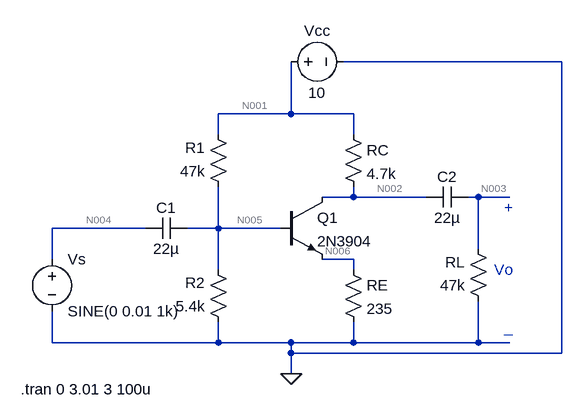
[diagram p0: schematic Lab8Pre2.asc]
Lab8Pre2.asc, the LTspice schematic file:
Version 4
SHEET 1 880 680
WIRE 832 -80 496 -80
WIRE 416 0 416 -80
WIRE 416 0 304 0
WIRE 512 0 416 0
WIRE 304 32 304 0
WIRE 512 32 512 0
WIRE 512 128 512 112
WIRE 512 128 464 128
WIRE 624 128 512 128
WIRE 704 128 688 128
WIRE 752 128 704 128
WIRE 192 176 48 176
WIRE 304 176 304 112
WIRE 304 176 256 176
WIRE 400 176 304 176
WIRE 704 208 704 128
WIRE 48 224 48 176
WIRE 512 224 464 224
WIRE 304 240 304 176
WIRE 512 240 512 224
WIRE 48 352 48 304
WIRE 304 352 304 320
WIRE 304 352 48 352
WIRE 416 352 304 352
WIRE 512 352 512 320
WIRE 512 352 416 352
WIRE 704 352 704 288
WIRE 704 352 512 352
WIRE 752 352 704 352
WIRE 416 368 416 352
WIRE 832 368 832 -80
WIRE 832 368 416 368
WIRE 416 400 416 368
FLAG 416 400 0
SYMBOL cap 256 160 R90
WINDOW 0 0 32 VBottom 2
WINDOW 3 32 32 VTop 2
SYMATTR InstName C1
SYMATTR Value 22µ
SYMBOL cap 624 144 R270
WINDOW 0 32 32 VTop 2
WINDOW 3 0 32 VBottom 2
SYMATTR InstName C2
SYMATTR Value 22µ
SYMBOL res 320 128 R180
WINDOW 0 36 76 Left 2
WINDOW 3 36 40 Left 2
SYMATTR InstName R1
SYMATTR Value 47k
SYMBOL res 320 336 R180
WINDOW 0 36 76 Left 2
WINDOW 3 36 40 Left 2
SYMATTR InstName R2
SYMATTR Value 5.4k
SYMBOL res 496 224 R0
SYMATTR InstName RE
SYMATTR Value 235
SYMBOL res 496 16 R0
SYMATTR InstName RC
SYMATTR Value 4.7k
SYMBOL npn 400 128 R0
SYMATTR InstName Q1
SYMATTR Value 2N3904
SYMBOL voltage 400 -80 R270
WINDOW 0 32 56 VTop 2
WINDOW 3 -32 56 VBottom 2
SYMATTR InstName Vcc
SYMATTR Value 10
SYMBOL voltage 48 208 R0
WINDOW 123 0 0 Left 2
WINDOW 39 0 0 Left 2
SYMATTR InstName Vs
SYMATTR Value SINE(0 0.01 1k)
SYMBOL res 720 304 R180
WINDOW 0 36 76 Left 2
WINDOW 3 36 40 Left 2
SYMATTR InstName RL
SYMATTR Value 47k
TEXT 728 240 Left 2 ;Vo
TEXT 744 144 Left 2 ;+
TEXT 744 328 Left 2 ;_
TEXT 0 424 Left 2 !.tran 0 3.01 3 100u

The netlist it stands for:
* Lab8Pre2.asc
C1 N005 N004 22µ
C2 N002 N003 22µ
R1 N005 N001 47k
R2 0 N005 5.4k
RE N006 0 235
RC N001 N002 4.7k
Q1 N002 N005 N006 0 2N3904
Vcc N001 0 10
Vs N004 0 SINE(0 0.01 1k)
RL 0 N003 47k
.model NPN NPN
.model PNP PNP
.lib standard.bjt
* Vo
* +
* _
.tran 0 3.01 3 100u
.backanno
.end

* Results of the author's LTspice run, read from the files saved beside the schematic
* Operating Point, zero values left out:
*   V(n005) = 1.007 V
*   V(n002) = 3.165 V
*   V(n001) = 10 V
*   V(n006) = 342.9 mV
*   Ic(Q1) = 1.454 mA
*   Ib(Q1) = 4.762 µA
*   Ie(Q1) = -1.459 mA
*   I(Rc) = 1.454 mA
*   I(Re) = 1.459 mA
*   I(R2) = -186.6 µA
*   I(R1) = -191.3 µA
*   I(Vcc) = -1.646 mA
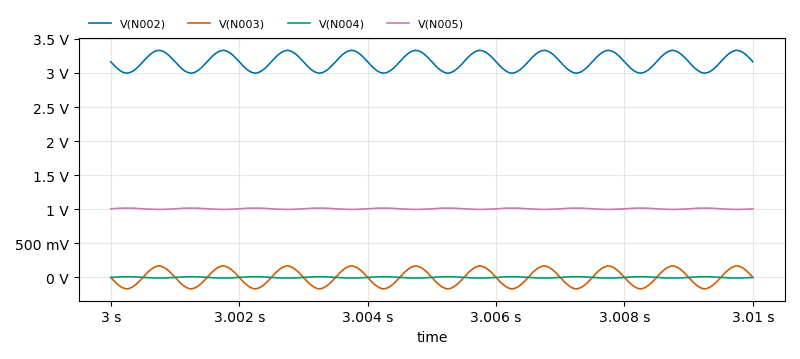
[diagram p1: Transient Analysis of Lab8Pre2.asc, plotted from the saved traces]
* Transient Analysis, 1 run:
*   V(N002): min 2.997 V, max 3.332 V, average 3.165 V, rms 3.167 V, last 3.165 V
*   V(N003): min -167.2 mV, max 167.1 mV, average -236.2 nV, rms 117.4 mV, last -198.9 µV
*   V(N004): min -9.976 mV, max 9.976 mV, average -104.3 nV, rms 7.004 mV, last 0 V
*   V(N005): min 997.5 mV, max 1.017 V, average 1.007 V, rms 1.007 V, last 1.007 V